# Altium schematic sheet Power.SchDoc: SmartCoin
size A4; Date: 22.06.2025; Author: Vamsi Krishna Sesham; Revision: A; SheetNumber: 5; SheetTotal: 5
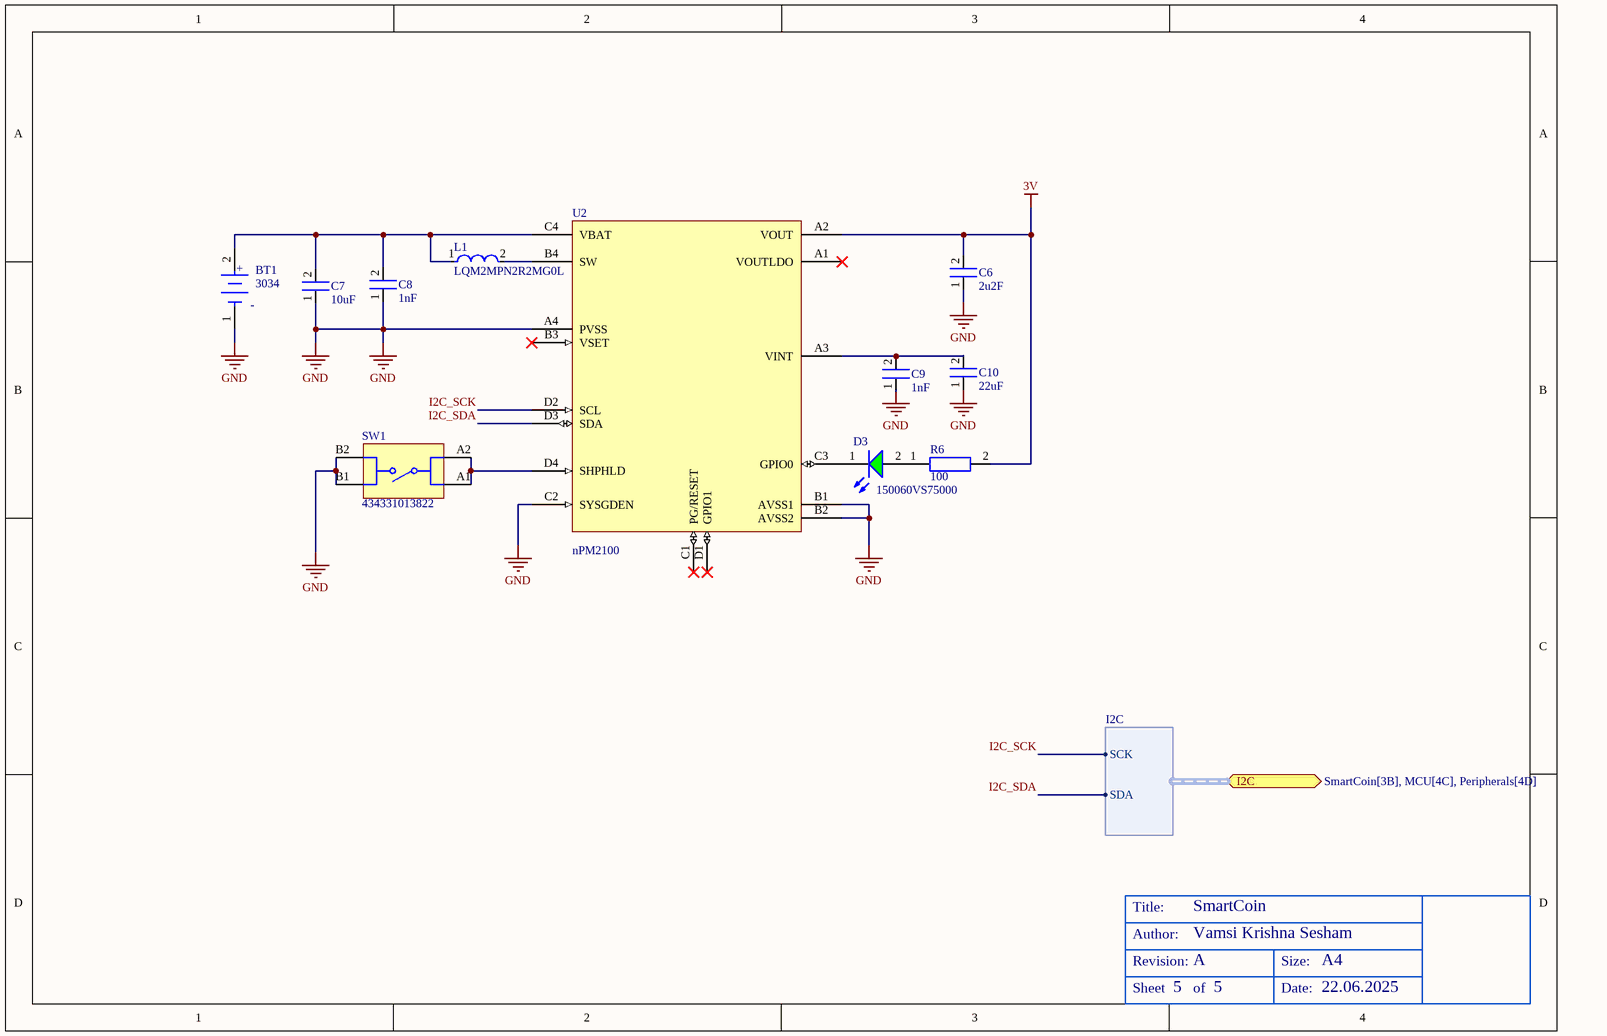
[diagram p0: Power.SchDoc]

## Parts
*  TitleBlock  (value not drawn)  (graphical)
BT1  3034  [FP-3034-MFG]
C6  2u2F  [Capacitor - 0201]
C7  10uF  [Capacitor - 0402]
C8  1nF  [Capacitor - 0201]
C9  1nF  [Capacitor - 0201]
C10  22uF  [Capacitor - 0402]
D3  150060VS75000  [WL-SMCW_0603_150060xx75000]
L1  LQM2MPN2R2MG0L  [FP-LQM2MPN_G0-IPC_A]
R6  100  [Resistor - 0201]
SW1  434331013822  [434331013822]
U2  nPM2100  [npm2100]

## Ports
I2C (bidir, harness I2C, see SmartCoin[3B], MCU[4C], Peripherals[4D])

## Harnesses
I2C: SCK, SDA

## Nets
3V: C6.2 R6.2 U2.A2(VOUT)
GND: BT1.1(C) C6.1 C7.1 C8.1 C9.1 C10.1 SW1.B1 SW1.B2 U2.A4(PVSS) U2.B1(AVSS1) U2.B2(AVSS2) U2.C2(SYSGDEN)
I2C_SCK: U2.D2(SCL) ; port I2C.SCK
I2C_SDA: U2.D3(SDA) ; port I2C.SDA
NetBT1_2: BT1.2(A) C7.2 C8.2 L1.1 U2.C4(VBAT)
NetC9_2: C9.2 C10.2 U2.A3(VINT)
NetD3_1: D3.1(K) U2.C3(GPIO0)
NetD3_2: D3.2(A) R6.1
NetL1_2: L1.2 U2.B4(SW)
NetSW1_A1: SW1.A1 SW1.A2 U2.D4(SHPHLD)

Not connected (* = marked no-connect by the designer): U2 A1(VOUTLDO)* B3(VSET)* C1(PG/RESET)* D1(GPIO1)*

## Notes on the sheet
- (in symbol CMP-19636-000006-1) +; -
- (in symbol TitleBlock) Title:; Author:; Revision:; Size:; A4; Sheet; of; Date:

## Library data of the parts
BT1 = CMP-19636-000006-1: BATTERY RETAINER COIN 20MM SMD; Manufacturer: Keystone Electronics; Number Of Contacts: 2; Height: 4.31mm; Device Class L1: Connectors; Device Class L3: unset; RoHS: TRUE; Automotive: No; Mouser Description: Coin Cell Battery Holders COIN CELL RETAINER; Contact Material: Nickel; Digikey Description: BATTERY RETAINER COIN 20MM SMD; Category: Batt; Package: 3034; ComponentLink2URL: https://www.keyelco.com/product-pdf.cfm?p=798; Manufacturer Part Number: 3034; Octopart: https://octopart.com/3034-keystone-27554462; ComponentLink2Description: Datasheet; Device Class L2: unset; Lead Free: Yes
C6 C8 C9 = Capacitor - 0201
C7 C10 = Capacitor - 0402
D3 = CMP-1426-00006-7: WURTH ELEKTRONIK - 150060VS75000 - LED, Green, SMD, 0603, 30 mA, 2 V, 570 nm; Reverse Voltage: 5V; Power Dissipation: 72mW; Dominant Wavelength: 570nm; Peak Wavelength: 572nm; Forward Current: 100mA; Forward Voltage: 2V; Lens Style: Clear, Rectangular; Test Current: 20mA; Max Junction Temperature (Tj): 95°C; Viewing Angle: 140°; Luminous Intensity: 40mcd; Height: 700µm; Width: 800µm; Length: 1.6mm; Mount: Surface Mount; Min Operating Temperature: -40°C; Max Reverse Voltage (DC): 5V; Case Code (Imperial): 0603; Wavelength: 570nm; Color: Green; REACH SVHC: Unknown; RoHS: Compliant; Max Operating Temperature: 85°C; Packaging: Tape and Reel; Case/Package: 0603; Number of Pins: 2; Case Code (Metric): 1608
L1 = CMP-06042-008995-1: Multilayer Type Inductor for Power Lines, 0806 (2016), 2.2μH, 20%, 0.138Ω, 1.2A; DC Resistance (DCR): 138mR; Inductance: 2.2uH; Self Resonant Frequency: 40MHz; Core Material: Ferrite; Shielding: Shielded; Test Frequency: 1MHz; Weight: 0.000353oz; Termination: SMD/SMT; Case Code (Metric): 2012; Height - Seated (Max): 0.039inch; Max Operating Temperature: 125°C; Length: 0.079inch; Max DC Current: 1.2A; Package Quantity: 3000; Width: 0.049inch; Min Operating Temperature: -55°C; Packaging: Tape and Reel; Height: 0.9mm; Tolerance: 20%; Mount: Surface Mount; Case/Package: 0805; Current Rating: 1.2A; Case Code (Imperial): 0805
R6 = Resistor - 0201
SW1 = CMP-03913-71472419-1: 434331013822 Tactile Switch, 0.05A, 12Vdc, 220Gf, Smd Rohs Compliant: Yes; Illumination Type: Non-Illuminated; Voltage Rating: 12V; Mechanical Life: 100kcycles; Throw Configuration: SPST; Actuator Material: Nylon, Polyamide; Switch Travel: 200µm; Switch Function: Off-Mom; Current Rating: 50mA; Insulation Resistance: 100MΩ; Height: 1.35mm; RoHS: Compliant; Termination: SMD/SMT; Mount: Surface Mount; NexarPartId: 71472419; Contact Material: Steel; Min Operating Temperature: -40°C; Packaging: Tape and Reel; Contact Plating: Silver; Max Operating Temperature: 85°C